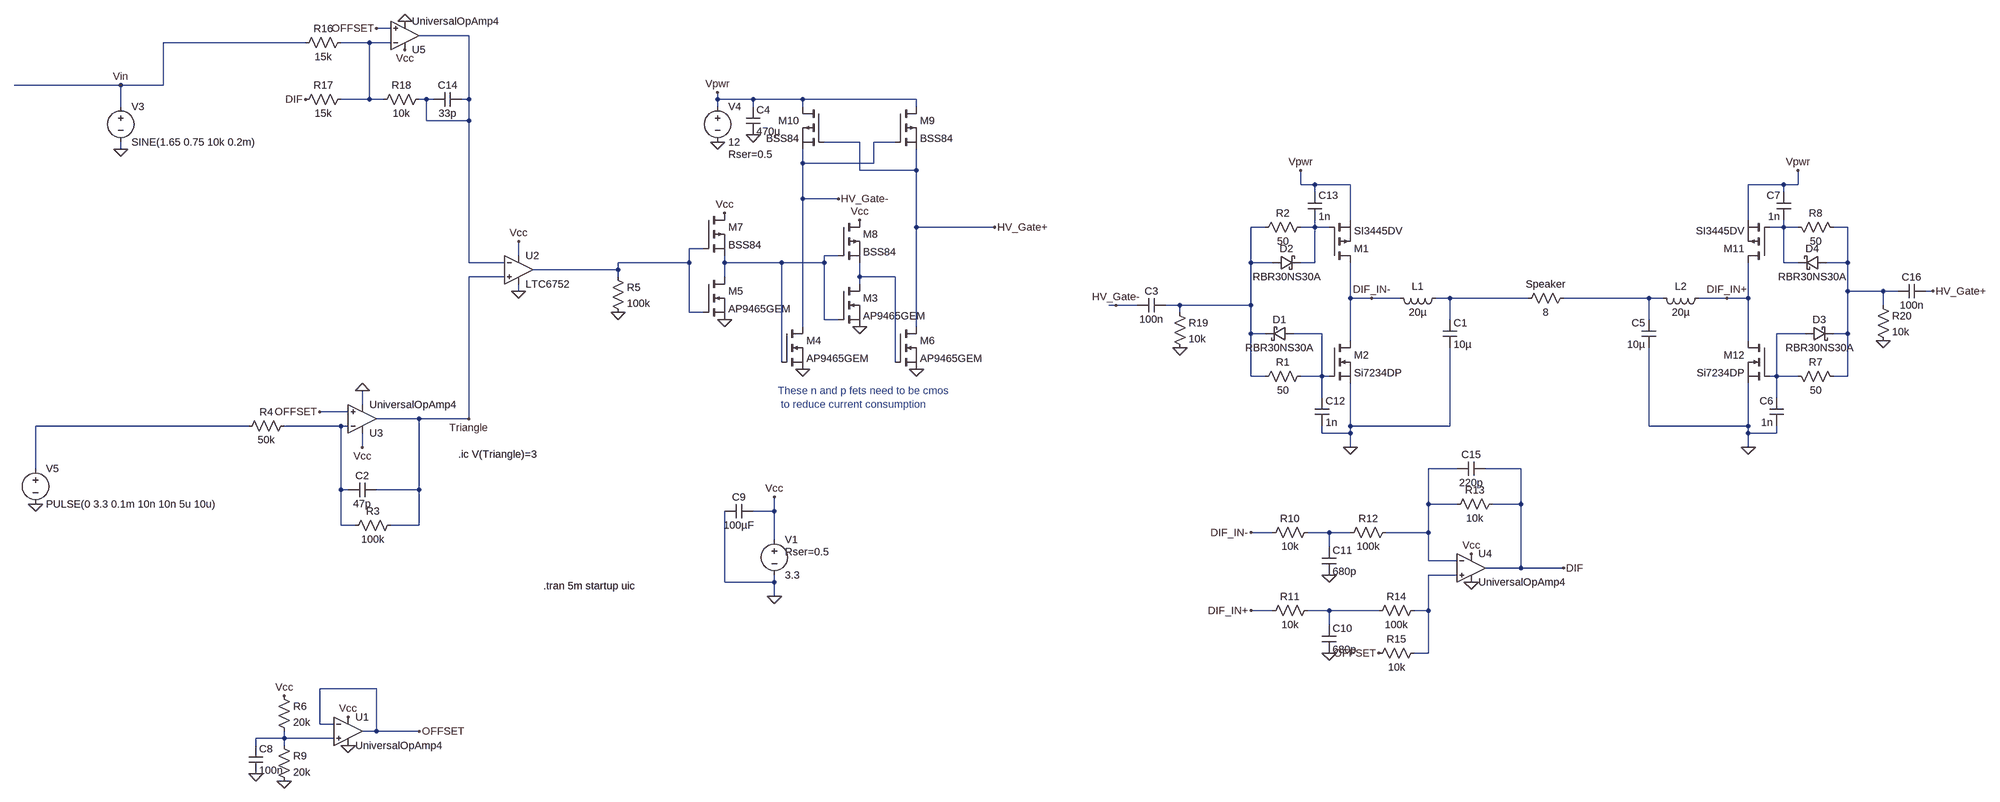
[diagram p0: schematic DClassAmplifier.asc]
DClassAmplifier.asc, the LTspice schematic file:
Version 4
SHEET 1 2664 1508
WIRE -1072 -208 -1104 -208
WIRE -896 -192 -1008 -192
WIRE -1264 -176 -1584 -176
WIRE -1120 -176 -1184 -176
WIRE -1072 -176 -1120 -176
WIRE -1680 -80 -1920 -80
WIRE -1584 -80 -1584 -176
WIRE -1584 -80 -1680 -80
WIRE -1120 -48 -1120 -176
WIRE -1120 -48 -1184 -48
WIRE -1088 -48 -1120 -48
WIRE -992 -48 -1008 -48
WIRE -976 -48 -992 -48
WIRE -896 -48 -896 -192
WIRE -896 -48 -912 -48
WIRE -336 -48 -336 -64
WIRE -256 -48 -336 -48
WIRE -144 -48 -256 -48
WIRE 112 -48 -144 -48
WIRE -1680 -32 -1680 -80
WIRE -336 -32 -336 -48
WIRE -256 -32 -256 -48
WIRE -144 -32 -144 -48
WIRE 112 -32 112 -48
WIRE -992 0 -992 -48
WIRE -896 0 -896 -48
WIRE -896 0 -992 0
WIRE -16 48 -96 48
WIRE 64 48 16 48
WIRE -1680 64 -1680 48
WIRE -144 96 -144 64
WIRE 16 96 16 48
WIRE 16 96 -144 96
WIRE -16 112 -16 48
WIRE 112 112 112 64
WIRE 112 112 -16 112
WIRE 1104 144 1104 112
WIRE 1136 144 1104 144
WIRE 1216 144 1136 144
WIRE 2192 144 2112 144
WIRE 2224 144 2224 112
WIRE 2224 144 2192 144
WIRE 1136 160 1136 144
WIRE 2192 160 2192 144
WIRE -144 176 -144 96
WIRE -64 176 -144 176
WIRE 1216 224 1216 144
WIRE 2112 224 2112 144
WIRE 112 240 112 112
WIRE 288 240 112 240
WIRE 1024 240 992 240
WIRE 1136 240 1136 224
WIRE 1136 240 1104 240
WIRE 1168 240 1136 240
WIRE 2192 240 2192 224
WIRE 2192 240 2160 240
WIRE 2224 240 2192 240
WIRE 2336 240 2304 240
WIRE -368 288 -400 288
WIRE -784 304 -784 272
WIRE -64 304 -96 304
WIRE -896 320 -896 0
WIRE -816 320 -896 320
WIRE -400 320 -400 288
WIRE -400 320 -560 320
WIRE -320 320 -320 304
WIRE -192 320 -320 320
WIRE -96 320 -96 304
WIRE -96 320 -192 320
WIRE 992 320 992 240
WIRE 1040 320 992 320
WIRE 1136 320 1136 240
WIRE 1136 320 1104 320
WIRE 2192 320 2192 240
WIRE 2224 320 2192 320
WIRE 2336 320 2336 240
WIRE 2336 320 2288 320
WIRE -560 336 -560 320
WIRE -560 336 -752 336
WIRE -816 352 -896 352
WIRE -560 352 -560 336
WIRE -320 352 -320 320
WIRE -16 352 -16 320
WIRE 64 352 -16 352
WIRE -16 368 -16 352
WIRE -784 384 -784 368
WIRE 2336 384 2336 320
WIRE 2416 384 2336 384
WIRE 2448 384 2416 384
WIRE 2528 384 2512 384
WIRE 1216 400 1216 320
WIRE 1264 400 1216 400
WIRE 1328 400 1264 400
WIRE 1440 400 1408 400
WIRE 1616 400 1440 400
WIRE 1888 400 1696 400
WIRE 1920 400 1888 400
WIRE 2064 400 2000 400
WIRE 2112 400 2112 320
WIRE 2112 400 2064 400
WIRE 688 416 672 416
WIRE 736 416 688 416
WIRE 832 416 800 416
WIRE 992 416 992 320
WIRE 992 416 832 416
WIRE 2416 416 2416 384
WIRE -400 432 -400 320
WIRE -368 432 -400 432
WIRE 832 432 832 416
WIRE -96 448 -96 320
WIRE -64 448 -96 448
WIRE 1440 448 1440 400
WIRE 1888 448 1888 400
WIRE -144 464 -144 176
WIRE 112 464 112 240
WIRE 992 480 992 416
WIRE 1024 480 992 480
WIRE 1152 480 1088 480
WIRE 2240 480 2176 480
WIRE 2336 480 2336 384
WIRE 2336 480 2304 480
WIRE 1216 496 1216 400
WIRE 2112 496 2112 400
WIRE -192 544 -192 320
WIRE 64 544 64 352
WIRE 992 576 992 480
WIRE 1024 576 992 576
WIRE 1152 576 1152 480
WIRE 1152 576 1104 576
WIRE 1168 576 1152 576
WIRE 2176 576 2176 480
WIRE 2176 576 2160 576
WIRE 2224 576 2176 576
WIRE 2336 576 2336 480
WIRE 2336 576 2304 576
WIRE 1152 624 1152 576
WIRE 2176 624 2176 576
WIRE -1136 640 -1136 608
WIRE -1168 656 -1232 656
WIRE -1008 672 -1104 672
WIRE -896 672 -896 352
WIRE -896 672 -1008 672
WIRE -1392 688 -1872 688
WIRE -1184 688 -1312 688
WIRE -1168 688 -1184 688
WIRE 1216 688 1216 592
WIRE 1440 688 1440 512
WIRE 1440 688 1216 688
WIRE 1888 688 1888 512
WIRE 2112 688 2112 592
WIRE 2112 688 1888 688
WIRE 1152 704 1152 688
WIRE 1216 704 1216 688
WIRE 1216 704 1152 704
WIRE 2112 704 2112 688
WIRE 2176 704 2176 688
WIRE 2176 704 2112 704
WIRE -1136 736 -1136 704
WIRE 1216 736 1216 704
WIRE 2112 736 2112 704
WIRE -1872 784 -1872 688
WIRE 1456 784 1392 784
WIRE 1600 784 1520 784
WIRE -1184 832 -1184 688
WIRE -1168 832 -1184 832
WIRE -1008 832 -1008 672
WIRE -1008 832 -1104 832
WIRE 1392 864 1392 784
WIRE 1456 864 1392 864
WIRE 1600 864 1600 784
WIRE 1600 864 1536 864
WIRE -208 880 -208 848
WIRE -208 880 -256 880
WIRE -1184 912 -1184 832
WIRE -1152 912 -1184 912
WIRE -1008 912 -1008 832
WIRE -1008 912 -1072 912
WIRE 1040 928 992 928
WIRE 1168 928 1120 928
WIRE 1216 928 1168 928
WIRE 1392 928 1392 864
WIRE 1392 928 1296 928
WIRE -208 944 -208 880
WIRE 1168 960 1168 928
WIRE 1392 992 1392 928
WIRE 1456 992 1392 992
WIRE 1600 1008 1600 864
WIRE 1600 1008 1520 1008
WIRE 1696 1008 1600 1008
WIRE 1456 1024 1392 1024
WIRE -320 1040 -320 880
WIRE -208 1040 -208 1024
WIRE -208 1040 -320 1040
WIRE -208 1072 -208 1040
WIRE 1040 1104 992 1104
WIRE 1168 1104 1120 1104
WIRE 1280 1104 1168 1104
WIRE 1392 1104 1392 1024
WIRE 1392 1104 1360 1104
WIRE 1168 1136 1168 1104
WIRE 1392 1200 1392 1104
WIRE 1392 1200 1360 1200
WIRE -1104 1280 -1232 1280
WIRE -1232 1360 -1232 1280
WIRE -1200 1360 -1232 1360
WIRE -1104 1376 -1104 1280
WIRE -1104 1376 -1136 1376
WIRE -1008 1376 -1104 1376
WIRE -1312 1392 -1312 1376
WIRE -1312 1392 -1376 1392
WIRE -1200 1392 -1312 1392
WIRE -1376 1408 -1376 1392
WIRE -1312 1408 -1312 1392
FLAG -208 1072 0
FLAG -208 848 Vcc
FLAG -784 272 Vcc
FLAG -1136 736 Vcc
FLAG -1680 64 0
FLAG -896 672 Triangle
FLAG -1680 -80 Vin
FLAG -1872 864 0
FLAG -1136 608 0
FLAG -784 384 0
FLAG 1216 736 0
FLAG -560 432 0
FLAG -320 448 0
FLAG -144 560 0
FLAG 112 560 0
FLAG -16 464 0
FLAG -320 208 Vcc
FLAG -16 224 Vcc
FLAG -336 -64 Vpwr
FLAG -336 48 0
FLAG 1104 112 Vpwr
FLAG 2112 736 0
FLAG 2224 112 Vpwr
FLAG -64 176 HV_Gate-
FLAG 688 416 HV_Gate-
FLAG 288 240 HV_Gate+
FLAG 2528 384 HV_Gate+
FLAG -256 32 0
FLAG -1168 1344 Vcc
FLAG -1312 1296 Vcc
FLAG -1168 1408 0
FLAG -1312 1488 0
FLAG -1376 1472 0
FLAG -1008 1376 OFFSET
FLAG -1232 656 OFFSET
FLAG 1488 976 Vcc
FLAG 1488 1040 0
FLAG 1168 1024 0
FLAG 1168 1200 0
FLAG 1280 1200 OFFSET
FLAG 1696 1008 DIF
FLAG 992 1104 DIF_IN+
FLAG 992 928 DIF_IN-
FLAG 1264 400 DIF_IN-
FLAG 2064 400 DIF_IN+
FLAG -1040 -160 Vcc
FLAG -1040 -224 0
FLAG -1264 -48 DIF
FLAG -1104 -208 OFFSET
FLAG 832 512 0
FLAG 2416 496 0
SYMBOL voltage -208 928 R0
WINDOW 123 0 0 Left 2
WINDOW 39 24 44 Left 2
SYMATTR SpiceLine Rser=0.5
SYMATTR InstName V1
SYMATTR Value 3.3
SYMBOL cap 1424 448 R0
SYMATTR InstName C1
SYMATTR Value 10µ
SYMBOL res 1712 384 R90
WINDOW 0 0 56 VBottom 2
WINDOW 3 32 56 VTop 2
SYMATTR InstName Speaker
SYMATTR Value 8
SYMBOL cap -256 864 R90
WINDOW 0 0 32 VBottom 2
WINDOW 3 32 32 VTop 2
SYMATTR InstName C9
SYMATTR Value 100µF
SYMBOL voltage -1680 -48 R0
WINDOW 123 0 0 Left 0
WINDOW 39 0 0 Left 0
SYMATTR InstName V3
SYMATTR Value SINE(1.65 0.75 10k 0.2m)
SYMBOL pmos 1168 320 M180
SYMATTR InstName M1
SYMATTR Value SI3445DV
SYMBOL nmos 1168 496 R0
SYMATTR InstName M2
SYMATTR Value Si7234DP
SYMBOL ind 1424 384 R90
WINDOW 0 5 56 VBottom 2
WINDOW 3 32 56 VTop 2
SYMATTR InstName L1
SYMATTR Value 20µ
SYMBOL res 1120 560 R90
WINDOW 0 0 56 VBottom 2
WINDOW 3 32 56 VTop 2
SYMATTR InstName R1
SYMATTR Value 50
SYMBOL res 1120 224 R90
WINDOW 0 0 56 VBottom 2
WINDOW 3 32 56 VTop 2
SYMATTR InstName R2
SYMATTR Value 50
SYMBOL cap 1136 624 R0
SYMATTR InstName C12
SYMATTR Value 1n
SYMBOL cap 1120 160 R0
SYMATTR InstName C13
SYMATTR Value 1n
SYMBOL schottky 1088 464 R90
WINDOW 0 0 32 VBottom 2
WINDOW 3 32 32 VTop 2
SYMATTR InstName D1
SYMATTR Value RBR30NS30A
SYMATTR Description Diode
SYMATTR Type diode
SYMBOL schottky 1040 336 R270
WINDOW 0 32 32 VTop 2
WINDOW 3 0 32 VBottom 2
SYMATTR InstName D2
SYMATTR Value RBR30NS30A
SYMATTR Description Diode
SYMATTR Type diode
SYMBOL voltage -1872 768 R0
WINDOW 123 0 0 Left 0
WINDOW 39 0 0 Left 0
SYMATTR InstName V5
SYMATTR Value PULSE(0 3.3 0.1m 10n 10n 5u 10u)
SYMBOL cap -1104 816 R90
WINDOW 0 0 32 VBottom 2
WINDOW 3 32 32 VTop 2
SYMATTR InstName C2
SYMATTR Value 47p
SYMATTR SpiceLine Rser=1m Lser=10n
SYMBOL res -1296 672 R90
WINDOW 0 0 56 VBottom 2
WINDOW 3 32 56 VTop 2
SYMATTR InstName R4
SYMATTR Value 50k
SYMBOL OpAmps\\UniversalOpAmp4 -1136 672 M180
SYMATTR InstName U3
SYMBOL res -1056 896 R90
WINDOW 0 0 56 VBottom 2
WINDOW 3 32 56 VTop 2
SYMATTR InstName R3
SYMATTR Value 100k
SYMBOL res -576 336 R0
SYMATTR InstName R5
SYMATTR Value 100k
SYMBOL pmos -368 208 R0
SYMATTR InstName M7
SYMATTR Value BSS84
SYMBOL voltage -336 -48 R0
WINDOW 123 0 0 Left 0
WINDOW 39 24 124 Left 2
SYMATTR SpiceLine Rser=0.5
SYMATTR InstName V4
SYMATTR Value 12
SYMBOL pmos -64 224 R0
SYMATTR InstName M8
SYMATTR Value BSS84
SYMBOL pmos 64 -32 R0
SYMATTR InstName M9
SYMATTR Value BSS84
SYMBOL pmos -96 -32 M0
SYMATTR InstName M10
SYMATTR Value BSS84
SYMBOL nmos 64 464 R0
SYMATTR InstName M6
SYMATTR Value AP9465GEM
SYMBOL nmos -64 368 R0
SYMATTR InstName M3
SYMATTR Value AP9465GEM
SYMBOL nmos -192 464 R0
SYMATTR InstName M4
SYMATTR Value AP9465GEM
SYMBOL nmos -368 352 R0
SYMATTR InstName M5
SYMATTR Value AP9465GEM
SYMBOL Comparators\\LTC6752 -784 272 R0
SYMATTR InstName U2
SYMBOL cap 1904 448 M0
SYMATTR InstName C5
SYMATTR Value 10µ
SYMBOL pmos 2160 320 R180
SYMATTR InstName M11
SYMATTR Value SI3445DV
SYMBOL nmos 2160 496 M0
SYMATTR InstName M12
SYMATTR Value Si7234DP
SYMBOL ind 1904 384 M90
WINDOW 0 5 56 VBottom 2
WINDOW 3 32 56 VTop 2
SYMATTR InstName L2
SYMATTR Value 20µ
SYMBOL res 2208 560 M90
WINDOW 0 0 56 VBottom 2
WINDOW 3 32 56 VTop 2
SYMATTR InstName R7
SYMATTR Value 50
SYMBOL res 2208 224 M90
WINDOW 0 0 56 VBottom 2
WINDOW 3 32 56 VTop 2
SYMATTR InstName R8
SYMATTR Value 50
SYMBOL cap 2192 624 M0
SYMATTR InstName C6
SYMATTR Value 1n
SYMBOL cap 2208 160 M0
SYMATTR InstName C7
SYMATTR Value 1n
SYMBOL schottky 2240 464 M90
WINDOW 0 0 32 VBottom 2
WINDOW 3 32 32 VTop 2
SYMATTR InstName D3
SYMATTR Value RBR30NS30A
SYMATTR Description Diode
SYMATTR Type diode
SYMBOL schottky 2288 336 M270
WINDOW 0 32 32 VTop 2
WINDOW 3 0 32 VBottom 2
SYMATTR InstName D4
SYMATTR Value RBR30NS30A
SYMATTR Description Diode
SYMATTR Type diode
SYMBOL cap -272 -32 R0
SYMATTR InstName C4
SYMATTR Value 470µ
SYMBOL OpAmps\\UniversalOpAmp4 -1168 1376 R0
SYMATTR InstName U1
SYMBOL res -1328 1280 R0
SYMATTR InstName R6
SYMATTR Value 20k
SYMBOL res -1328 1392 R0
SYMATTR InstName R9
SYMATTR Value 20k
SYMBOL cap -1392 1408 R0
SYMATTR InstName C8
SYMATTR Value 100n
SYMBOL OpAmps\\UniversalOpAmp4 1488 1008 R0
SYMATTR InstName U4
SYMBOL res 1136 912 R90
WINDOW 0 0 56 VBottom 2
WINDOW 3 32 56 VTop 2
SYMATTR InstName R10
SYMATTR Value 10k
SYMBOL res 1136 1088 R90
WINDOW 0 0 56 VBottom 2
WINDOW 3 32 56 VTop 2
SYMATTR InstName R11
SYMATTR Value 10k
SYMBOL cap 1152 1136 R0
SYMATTR InstName C10
SYMATTR Value 680p
SYMBOL cap 1152 960 R0
SYMATTR InstName C11
SYMATTR Value 680p
SYMBOL res 1312 912 R90
WINDOW 0 0 56 VBottom 2
WINDOW 3 32 56 VTop 2
SYMATTR InstName R12
SYMATTR Value 100k
SYMBOL res 1552 848 R90
WINDOW 0 0 56 VBottom 2
WINDOW 3 32 56 VTop 2
SYMATTR InstName R13
SYMATTR Value 10k
SYMBOL cap 1520 768 R90
WINDOW 0 0 32 VBottom 2
WINDOW 3 32 32 VTop 2
SYMATTR InstName C15
SYMATTR Value 220p
SYMBOL res 1376 1088 R90
WINDOW 0 0 56 VBottom 2
WINDOW 3 32 56 VTop 2
SYMATTR InstName R14
SYMATTR Value 100k
SYMBOL res 1376 1184 R90
WINDOW 0 0 56 VBottom 2
WINDOW 3 32 56 VTop 2
SYMATTR InstName R15
SYMATTR Value 10k
SYMBOL OpAmps\\UniversalOpAmp4 -1040 -192 M180
SYMATTR InstName U5
SYMBOL res -1168 -192 R90
WINDOW 0 0 56 VBottom 2
WINDOW 3 32 56 VTop 2
SYMATTR InstName R16
SYMATTR Value 15k
SYMBOL res -1168 -64 R90
WINDOW 0 0 56 VBottom 2
WINDOW 3 32 56 VTop 2
SYMATTR InstName R17
SYMATTR Value 15k
SYMBOL res -992 -64 R90
WINDOW 0 0 56 VBottom 2
WINDOW 3 32 56 VTop 2
SYMATTR InstName R18
SYMATTR Value 10k
SYMBOL cap -912 -64 R90
WINDOW 0 0 32 VBottom 2
WINDOW 3 32 32 VTop 2
SYMATTR InstName C14
SYMATTR Value 33p
SYMBOL cap 800 400 R90
WINDOW 0 0 32 VBottom 2
WINDOW 3 32 32 VTop 2
SYMATTR InstName C3
SYMATTR Value 100n
SYMBOL res 816 416 R0
SYMATTR InstName R19
SYMATTR Value 10k
SYMBOL cap 2512 368 R90
WINDOW 0 0 32 VBottom 2
WINDOW 3 32 32 VTop 2
SYMATTR InstName C16
SYMATTR Value 100n
SYMBOL res 2400 400 R0
SYMATTR InstName R20
SYMATTR Value 10k
TEXT -728 1048 Left 2 !.tran 5m startup uic
TEXT -920 752 Left 2 !.ic V(Triangle)=3
TEXT -200 608 Left 2 ;These n and p fets need to be cmos\n to reduce current consumption

The netlist it stands for:
* DClassAmplifier.asc
V1 Vcc 0 3.3 Rser=0.5
C1 N010 0 10µ
R§Speaker N011 N010 8
C9 Vcc 0 100µF
V3 Vin 0 SINE(1.65 0.75 10k 0.2m)
M1 DIF_IN- N004 Vpwr Vpwr SI3445DV
M2 DIF_IN- N012 0 0 Si7234DP
L1 N010 DIF_IN- 20µ
R1 N012 N003 50
R2 N004 N003 50
C12 N012 0 1n
C13 Vpwr N004 1n
D1 N012 N003 RBR30NS30A
D2 N003 N004 RBR30NS30A
V5 N014 0 PULSE(0 3.3 0.1m 10n 10n 5u 10u)
C2 Triangle N015 47p Rser=1m Lser=10n
R4 N015 N014 50k
* U3: UniversalOpAmp4 (symbol OpAmps\UniversalOpAmp4 not available, pins judged from their places): In+=OFFSET In-=N015 V+=Vcc V-=0 OUT=Triangle
R3 Triangle N015 100k
R5 N007 0 100k
M7 Vcc N007 N008 N008 BSS84
V4 Vpwr 0 12 Rser=0.5
M8 Vcc N008 N009 N009 BSS84
M9 Vpwr HV_Gate- HV_Gate+ HV_Gate+ BSS84
M10 Vpwr HV_Gate+ HV_Gate- HV_Gate- BSS84
M6 HV_Gate+ N009 0 0 AP9465GEM
M3 N009 N008 0 0 AP9465GEM
M4 HV_Gate- N008 0 0 AP9465GEM
M5 N008 N007 0 0 AP9465GEM
XU2 Triangle N001 Vcc 0 N007 LTC6752  ; pins In+ In- V+ V- OUT
C5 N011 0 10µ
M11 DIF_IN+ N005 Vpwr Vpwr SI3445DV
M12 DIF_IN+ N013 0 0 Si7234DP
L2 N011 DIF_IN+ 20µ
R7 N013 N006 50
R8 N005 N006 50
C6 N013 0 1n
C7 Vpwr N005 1n
D3 N013 N006 RBR30NS30A
D4 N006 N005 RBR30NS30A
C4 Vpwr 0 470µ
* U1: UniversalOpAmp4 (symbol OpAmps\UniversalOpAmp4 not available, pins judged from their places): In+=N020 In-=OFFSET V+=Vcc V-=0 OUT=OFFSET
R6 Vcc N020 20k
R9 N020 0 20k
C8 N020 0 100n
* U4: UniversalOpAmp4 (symbol OpAmps\UniversalOpAmp4 not available, pins judged from their places): In+=N018 In-=N016 V+=Vcc V-=0 OUT=DIF
R10 N017 DIF_IN- 10k
R11 N019 DIF_IN+ 10k
C10 N019 0 680p
C11 N017 0 680p
R12 N016 N017 100k
R13 DIF N016 10k
C15 DIF N016 220p
R14 N018 N019 100k
R15 N018 OFFSET 10k
* U5: UniversalOpAmp4 (symbol OpAmps\UniversalOpAmp4 not available, pins judged from their places): In+=OFFSET In-=N002 V+=Vcc V-=0 OUT=N001
R16 N002 Vin 15k
R17 N002 DIF 15k
R18 N001 N002 10k
C14 N001 N001 33p
C3 N003 HV_Gate- 100n
R19 N003 0 10k
C16 HV_Gate+ N006 100n
R20 N006 0 10k
.model D D
.lib standard.dio
.model NMOS NMOS
.model PMOS PMOS
.lib standard.mos
.tran 5m startup uic
.ic V(Triangle)=3
* These n and p fets need to be cmos
*  to reduce current consumption
.lib LTC7.lib
.backanno
.end